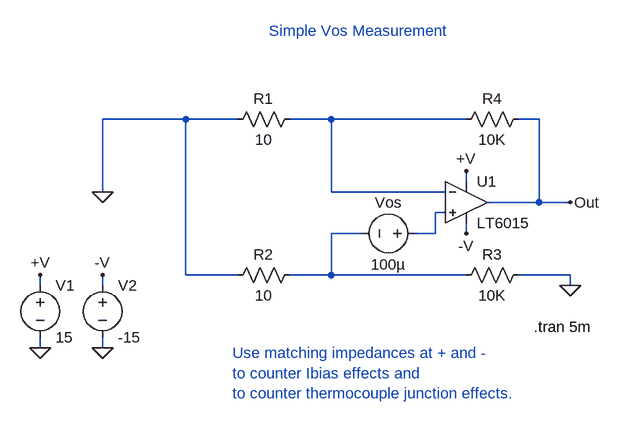
[diagram p0: schematic VosExample.asc]
VosExample.asc, the LTspice schematic file:
Version 4
SHEET 1 880 680
WIRE -16 64 -144 64
WIRE 64 64 -16 64
WIRE 208 64 144 64
WIRE 416 64 208 64
WIRE 528 64 496 64
WIRE 416 160 416 144
WIRE -144 176 -144 64
WIRE 208 176 208 64
WIRE 384 176 208 176
WIRE 528 192 528 64
WIRE 528 192 448 192
WIRE 576 192 528 192
WIRE 384 208 368 208
WIRE 256 240 208 240
WIRE 368 240 368 208
WIRE 368 240 336 240
WIRE 416 240 416 224
WIRE -16 304 -16 64
WIRE 64 304 -16 304
WIRE 208 304 208 240
WIRE 208 304 144 304
WIRE 416 304 208 304
WIRE 576 304 496 304
WIRE -240 320 -240 304
WIRE -144 320 -144 304
WIRE 576 320 576 304
WIRE -240 416 -240 400
WIRE -144 416 -144 400
FLAG -240 416 0
FLAG -144 416 0
FLAG -240 304 +V
FLAG 416 240 -V
FLAG -144 176 0
FLAG 576 320 0
FLAG 576 192 Out
FLAG 416 144 +V
FLAG -144 304 -V
SYMBOL voltage -240 304 R0
WINDOW 123 0 0 Left 0
WINDOW 39 0 0 Left 0
SYMATTR InstName V1
SYMATTR Value 15
SYMBOL voltage -144 304 R0
WINDOW 123 0 0 Left 0
WINDOW 39 0 0 Left 0
SYMATTR InstName V2
SYMATTR Value -15
SYMBOL res 160 48 R90
WINDOW 0 0 56 VBottom 2
WINDOW 3 32 56 VTop 2
SYMATTR InstName R1
SYMATTR Value 10
SYMBOL res 160 288 R90
WINDOW 0 0 56 VBottom 2
WINDOW 3 32 56 VTop 2
SYMATTR InstName R2
SYMATTR Value 10
SYMBOL res 512 288 R90
WINDOW 0 0 56 VBottom 2
WINDOW 3 32 56 VTop 2
SYMATTR InstName R3
SYMATTR Value 10K
SYMBOL res 512 48 R90
WINDOW 0 0 56 VBottom 2
WINDOW 3 32 56 VTop 2
SYMATTR InstName R4
SYMATTR Value 10K
SYMBOL Opamps\\LT6015 416 192 R0
SYMATTR InstName U1
SYMBOL voltage 352 240 R90
WINDOW 0 -32 56 VBottom 2
WINDOW 3 32 56 VTop 2
WINDOW 123 0 0 Left 0
WINDOW 39 0 0 Left 0
SYMATTR InstName Vos
SYMATTR Value 100µ
TEXT 520 384 Left 2 !.tran 5m
TEXT 112 -72 Left 2 ;Simple Vos Measurement
TEXT 56 424 Left 2 ;Use matching impedances at + and -\nto counter Ibias effects and \nto counter thermocouple junction effects.

The netlist it stands for:
* VosExample.asc
V1 +V 0 15
V2 -V 0 -15
R1 N001 0 10
R2 N003 0 10
R3 0 N003 10K
R4 Out N001 10K
XU1 N002 N001 +V -V Out LT6016  ; LT6015, pins In+ In- V+ V- OUT
Vos N002 N003 100µ
.tran 5m
* Simple Vos Measurement
* Use matching impedances at + and -
* to counter Ibias effects and
* to counter thermocouple junction effects.
.lib LTC2.lib
.backanno
.end